# EAGLE schematic DP_eDP_Adapter_v2.0 (EAGLE 6.4)

## Sheet 1 of 3
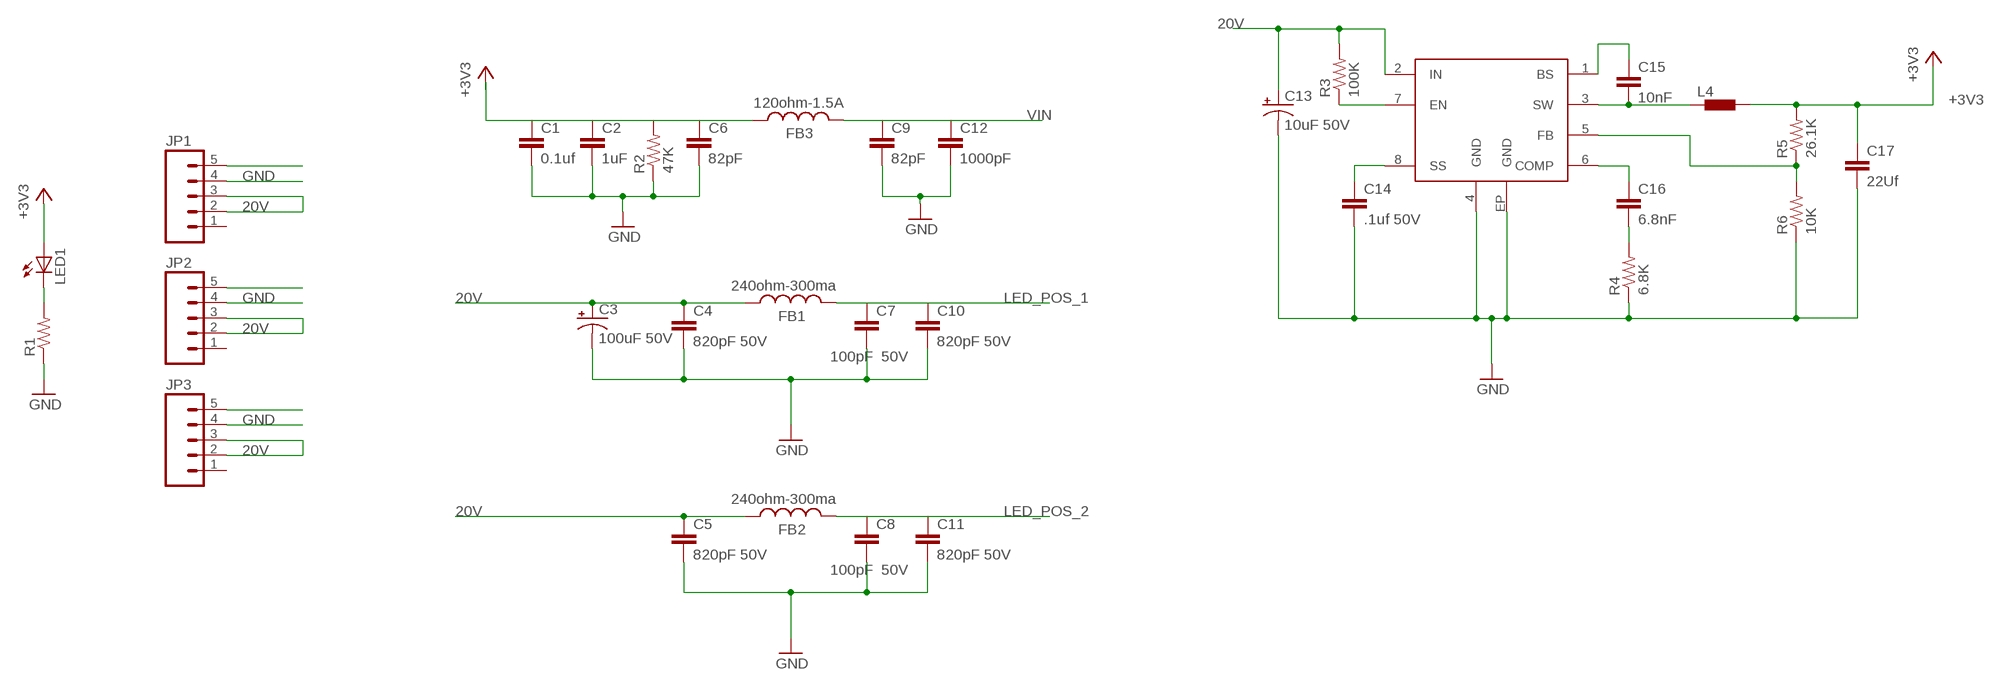
[diagram p0: schematic, sheet 1]

### Parts
C1  0.1uf  CAP0402-CAP  [0402-CAP]
C2  1uF  CAP0402-CAP  [0402-CAP]
C3  100uF 50V  CAP_POL6032  [EIA6032]
C4  820pF 50V  CAP0402-CAP  [0402-CAP]
C5  820pF 50V  CAP0402-CAP  [0402-CAP]
C6  82pF  CAP0402-CAP  [0402-CAP]
C7  100pF 50V  CAP0402-CAP  [0402-CAP]
C8  100pF 50V  CAP0402-CAP  [0402-CAP]
C9  82pF  CAP0402-CAP  [0402-CAP]
C10  820pF 50V  CAP0402-CAP  [0402-CAP]
C11  820pF 50V  CAP0402-CAP  [0402-CAP]
C12  1000pF  CAP0402-CAP  [0402-CAP]
C13  10uF 50V  CAP_POL6032  [EIA6032]
C14  .1uf 50V  CAP0402-CAP  [0402-CAP]
C15  10nF  CAP1206  [1206]
C16  6.8nF  CAP0402-CAP  [0402-CAP]
C17  22Uf  CAP0805  [0805]
FB1  240ohm-300ma  L-US  [R0402]
FB2  240ohm-300ma  L-US  [R0402]
FB3  120ohm-1.5A  L-US  [R0402]
IC1  AP6502A  [SO8-EP]
JP1  M05PTH  [1X05]
JP2  M05PTH  [1X05]
JP3  M05PTH  [1X05]
L4  INDUCTORS_DR10300520C  [0520C]
LED1  LED_LEDCHIPLED_1206  [LED_CHIPLED_1206]
R1  RESISTOR0402-RES  [0402-RES]
R2  47K  RESISTOR0402-RES  [0402-RES]
R3  100K  RESISTOR0402-RES  [0402-RES]
R4  6.8K  RESISTOR0402-RES  [0402-RES]
R5  26.1K  RESISTOR0402-RES  [0402-RES]
R6  10K  RESISTOR0402-RES  [0402-RES]

### Nets
20V [Power]: C3.P$1(+) C4.1 C5.1 C13.P$1(+) FB1.1 FB2.1 IC1.2(IN) JP1.2 JP1.3 JP2.2 JP2.3 JP3.2 JP3.3 R3.2
+3V3: C1.1 C2.1 C6.1 C17.1 FB3.1 L4.P$2 LED1.A R2.2 R5.2 ; also sheet 2,3
GND: C1.2 C2.2 C3.P$2(-) C4.2 C5.2 C6.2 C7.2 C8.2 C9.2 C10.2 C11.2 C12.2 C13.P$2(-) C14.2 C17.2 IC1.4(GND) IC1.EP(GND) JP1.4 JP1.5 JP2.4 JP2.5 JP3.4 JP3.5 R1.1 R2.1 R4.1 R6.1 ; also sheet 2,3
LED_POS_1: C7.1 C10.1 FB1.2 ; also sheet 3
LED_POS_2: C8.1 C11.1 FB2.2 ; also sheet 3
N$2: IC1.7(EN) R3.1
N$3: LED1.C R1.2
N$7: C14.1 IC1.8(SS)
N$8: C16.1 IC1.6(COMP)
N$9: C16.2 R4.2
N$10: IC1.5(FB) R5.1 R6.2
N$14: C15.2 IC1.3(SW) L4.P$1
N$18: C15.1 IC1.1(BS)
VIN: C9.1 C12.1 FB3.2 ; also sheet 3
Unconnected: JP1.1 JP2.1 JP3.1

## Sheet 2 of 3
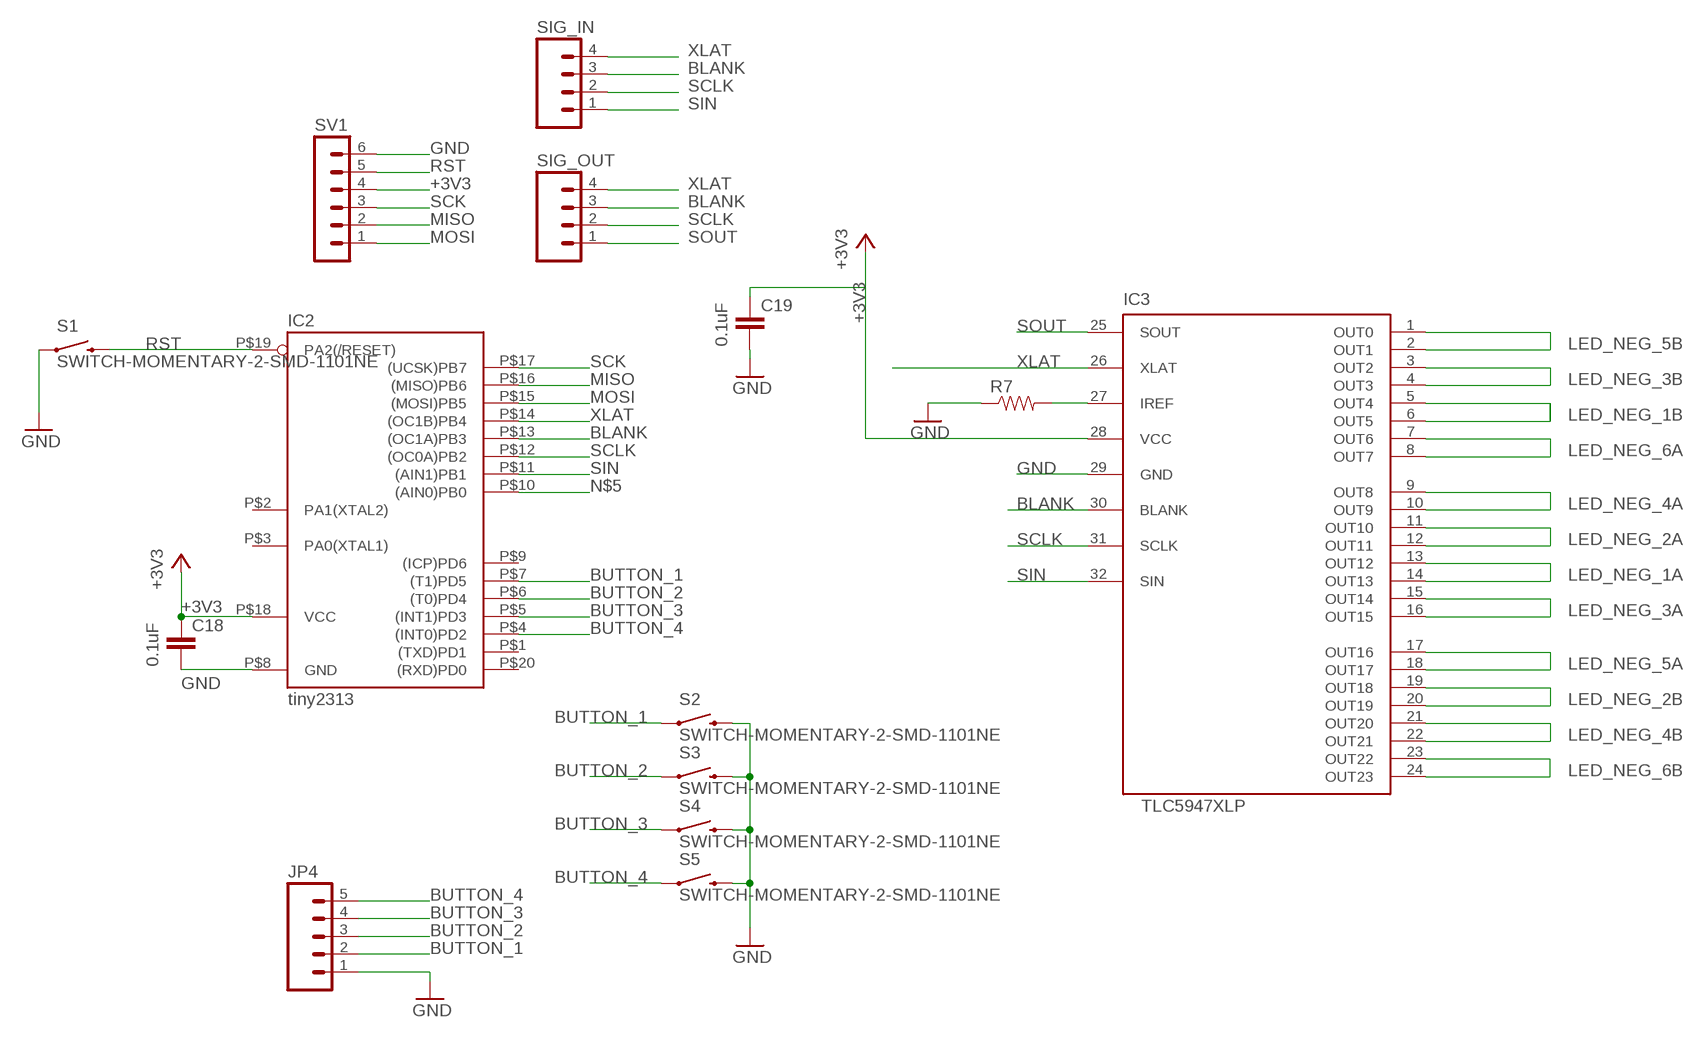
[diagram p1: schematic, sheet 2]

### Parts
C18  0.1uF  CAP0402-CAP  [0402-CAP]
C19  0.1uF  CAP0402-CAP  [0402-CAP]
IC2  tiny2313  TINY2313-*M*  [MLF20]
IC3  TLC5947XLP  [QFN32_XLP]
JP4  M05PTH  [1X05]
R7  RESISTOR0402-RES  [0402-RES]
S1  SWITCH-MOMENTARY-2-SMD-1101NE  [TACTILE-SWITCH-1101NE]
S2  SWITCH-MOMENTARY-2-SMD-1101NE  [TACTILE-SWITCH-1101NE]
S3  SWITCH-MOMENTARY-2-SMD-1101NE  [TACTILE-SWITCH-1101NE]
S4  SWITCH-MOMENTARY-2-SMD-1101NE  [TACTILE-SWITCH-1101NE]
S5  SWITCH-MOMENTARY-2-SMD-1101NE  [TACTILE-SWITCH-1101NE]
SIG_IN  M04PTH  [1X04]
SIG_OUT  M04PTH  [1X04]
SV1  MA06-1  [MA06-1]

### Nets
+3V3: C18.1 C19.1 IC2.P$18(VCC) IC3.28(VCC) SV1.4 ; also sheet 1,3
BLANK: IC2.P$13((OC1A)PB3) IC3.30(BLANK) SIG_IN.3 SIG_OUT.3
BUTTON_1: IC2.P$7((T1)PD5) JP4.2 S2.P$1
BUTTON_2: IC2.P$6((T0)PD4) JP4.3 S3.P$1
BUTTON_3: IC2.P$5((INT1)PD3) JP4.4 S4.P$1
BUTTON_4: IC2.P$4((INT0)PD2) JP4.5 S5.P$1
GND: C18.2 C19.2 IC2.P$8(GND) IC3.29(GND) JP4.1 R7.1 S1.P$1 S2.P$2 S3.P$2 S4.P$2 S5.P$2 SV1.6 ; also sheet 1,3
LED_NEG_1A: IC3.13(OUT12) IC3.14(OUT13) ; also sheet 3
LED_NEG_1B: IC3.5(OUT4) IC3.6(OUT5) ; also sheet 3
LED_NEG_2A: IC3.11(OUT10) IC3.12(OUT11) ; also sheet 3
LED_NEG_2B: IC3.19(OUT18) IC3.20(OUT19) ; also sheet 3
LED_NEG_3A: IC3.15(OUT14) IC3.16(OUT15) ; also sheet 3
LED_NEG_3B: IC3.3(OUT2) IC3.4(OUT3) ; also sheet 3
LED_NEG_4A: IC3.9(OUT8) IC3.10(OUT9) ; also sheet 3
LED_NEG_4B: IC3.21(OUT20) IC3.22(OUT21) ; also sheet 3
LED_NEG_5A: IC3.17(OUT16) IC3.18(OUT17) ; also sheet 3
LED_NEG_5B: IC3.1(OUT0) IC3.2(OUT1) ; also sheet 3
LED_NEG_6A: IC3.7(OUT6) IC3.8(OUT7) ; also sheet 3
LED_NEG_6B: IC3.23(OUT22) IC3.24(OUT23) ; also sheet 3
MISO: IC2.P$16((MISO)PB6) SV1.2
MOSI: IC2.P$15((MOSI)PB5) SV1.1
N$5: IC2.P$10((AIN0)PB0)
N$13: IC3.27(IREF) R7.2
RST: IC2.P$19(PA2(/RESET)) S1.P$2 SV1.5
SCK: IC2.P$17((UCSK)PB7) SV1.3
SCLK: IC2.P$12((OC0A)PB2) IC3.31(SCLK) SIG_IN.2 SIG_OUT.2
SIN: IC2.P$11((AIN1)PB1) IC3.32(SIN) SIG_IN.1
SOUT: IC3.25(SOUT) SIG_OUT.1
XLAT: IC2.P$14((OC1B)PB4) IC3.26(XLAT) SIG_IN.4 SIG_OUT.4
Unconnected: IC2.P$1((TXD)PD1) IC2.P$2(PA1(XTAL2)) IC2.P$3(PA0(XTAL1)) IC2.P$9((ICP)PD6) IC2.P$20((RXD)PD0)

## Sheet 3 of 3
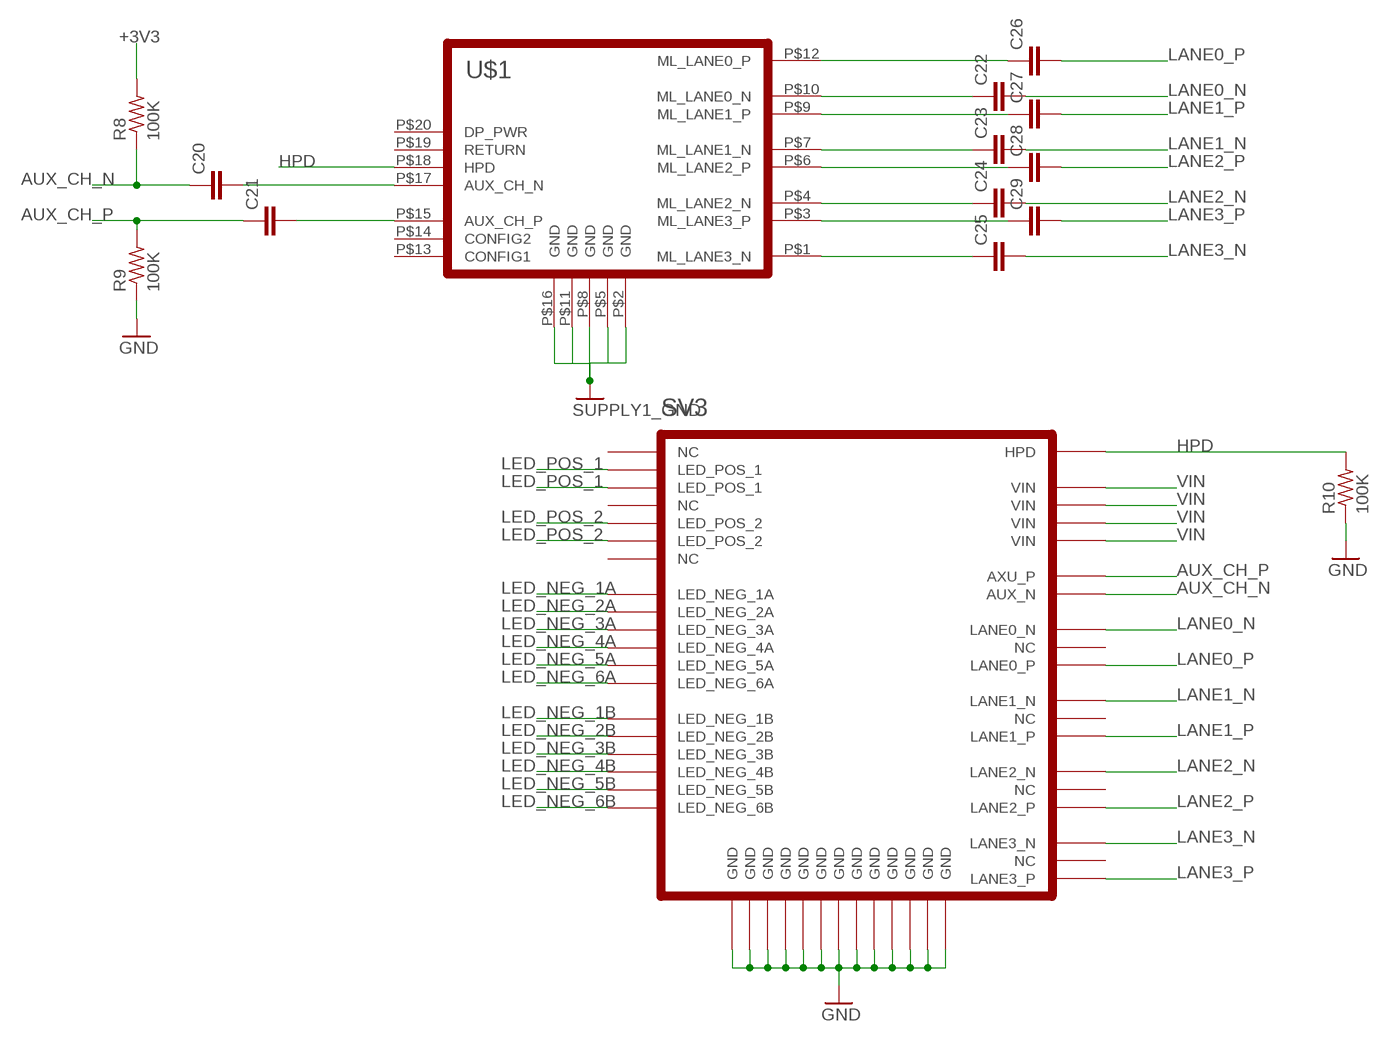
[diagram p2: schematic, sheet 3]

### Parts
C20  SPARKFUN-PASSIVES_CAP0402-CAP  [SPARKFUN-PASSIVES_0402-CAP]
C21  SPARKFUN-PASSIVES_CAP0402-CAP  [SPARKFUN-PASSIVES_0402-CAP]
C22  SPARKFUN-PASSIVES_CAP0402-CAP  [SPARKFUN-PASSIVES_0402-CAP]
C23  SPARKFUN-PASSIVES_CAP0402-CAP  [SPARKFUN-PASSIVES_0402-CAP]
C24  SPARKFUN-PASSIVES_CAP0402-CAP  [SPARKFUN-PASSIVES_0402-CAP]
C25  SPARKFUN-PASSIVES_CAP0402-CAP  [SPARKFUN-PASSIVES_0402-CAP]
C26  SPARKFUN-PASSIVES_CAP0402-CAP  [SPARKFUN-PASSIVES_0402-CAP]
C27  SPARKFUN-PASSIVES_CAP0402-CAP  [SPARKFUN-PASSIVES_0402-CAP]
C28  SPARKFUN-PASSIVES_CAP0402-CAP  [SPARKFUN-PASSIVES_0402-CAP]
C29  SPARKFUN-PASSIVES_CAP0402-CAP  [SPARKFUN-PASSIVES_0402-CAP]
R8  100K  R-US_R0402  [R0402]
R9  100K  R-US_R0402  [R0402]
R10  100K  R-US_R0402  [R0402]
SV3  DP_EDP_ADAPTER_DP_EDP_ADAPTER_EDP_CONNECTOR  [DP_EDP_ADAPTER_DP_EDP_ADAPTER_EDP_MOLEX]
U$1  DP_EDP_ADAPTER_DP1RD20JQ2R400_SINK  [DP_EDP_ADAPTER_DP_REVERSE_JAE]

### Nets
+3V3: R8.2 ; also sheet 1,2
AUX_CH_N: C20.1 R8.1 SV3.P$10(AUX_N)
AUX_CH_P: C21.1 R9.2 SV3.P$9(AXU_P)
AUX_N: C20.2 U$1.P$17(AUX_CH_N)
AUX_P: C21.2 U$1.P$15(AUX_CH_P)
GND: R9.1 R10.1 SV3.P$1(GND) SV3.P$3(GND) SV3.P$8(GND) SV3.P$11(GND) SV3.P$15(GND) SV3.P$19(GND) SV3.P$23(GND) SV3.P$27(GND) SV3.P$28(GND) SV3.P$29(GND) SV3.P$36(GND) SV3.P$43(GND) SV3.P$51(GND) U$1.P$2(GND) U$1.P$5(GND) U$1.P$8(GND) U$1.P$11(GND) U$1.P$16(GND) ; supply symbol labelled SUPPLY1_GND ; also sheet 1,2
HPD: R10.2 SV3.P$2(HPD) U$1.P$18(HPD)
LANE0_N: C22.2 SV3.P$12(LANE0_N)
LANE0_P: C26.2 SV3.P$14(LANE0_P)
LANE1_N: C23.2 SV3.P$16(LANE1_N)
LANE1_P: C27.2 SV3.P$18(LANE1_P)
LANE2_N: C24.2 SV3.P$20(LANE2_N)
LANE2_P: C28.2 SV3.P$22(LANE2_P)
LANE3_N [DP]: C25.2 SV3.P$24(LANE3_N)
LANE3_P [DP]: C29.2 SV3.P$26(LANE3_P)
LED_NEG_1A: SV3.P$42(LED_NEG_1A) ; also sheet 2
LED_NEG_1B: SV3.P$35(LED_NEG_1B) ; also sheet 2
LED_NEG_2A: SV3.P$41(LED_NEG_2A) ; also sheet 2
LED_NEG_2B: SV3.P$34(LED_NEG_2B) ; also sheet 2
LED_NEG_3A: SV3.P$40(LED_NEG_3A) ; also sheet 2
LED_NEG_3B: SV3.P$33(LED_NEG_3B) ; also sheet 2
LED_NEG_4A: SV3.P$39(LED_NEG_4A) ; also sheet 2
LED_NEG_4B: SV3.P$32(LED_NEG_4B) ; also sheet 2
LED_NEG_5A: SV3.P$38(LED_NEG_5A) ; also sheet 2
LED_NEG_5B: SV3.P$31(LED_NEG_5B) ; also sheet 2
LED_NEG_6A: SV3.P$37(LED_NEG_6A) ; also sheet 2
LED_NEG_6B: SV3.P$30(LED_NEG_6B) ; also sheet 2
LED_POS_1: SV3.P$48(LED_POS_1) SV3.P$49(LED_POS_1) ; also sheet 1
LED_POS_2: SV3.P$45(LED_POS_2) SV3.P$46(LED_POS_2) ; also sheet 1
N$3_N [DP]: C22.1 U$1.P$10(ML_LANE0_N)
N$3_P [DP]: C26.1 U$1.P$12(ML_LANE0_P)
N$15_N [DP]: C23.1 U$1.P$7(ML_LANE1_N)
N$15_P [DP]: C27.1 U$1.P$9(ML_LANE1_P)
N$17_N [DP]: C24.1 U$1.P$4(ML_LANE2_N)
N$17_P [DP]: C28.1 U$1.P$6(ML_LANE2_P)
N$19_N [DP]: C25.1 U$1.P$1(ML_LANE3_N)
N$19_P [DP]: C29.1 U$1.P$3(ML_LANE3_P)
VIN: SV3.P$4(VIN) SV3.P$5(VIN) SV3.P$6(VIN) SV3.P$7(VIN) ; also sheet 1
Unconnected: SV3.P$13(NC) SV3.P$17(NC) SV3.P$21(NC) SV3.P$25(NC) SV3.P$44(NC) SV3.P$47(NC) SV3.P$50(NC) U$1.P$13(CONFIG1) U$1.P$14(CONFIG2) U$1.P$19(RETURN) U$1.P$20(DP_PWR)

## Library data of the parts
C1 C2 C4-C12 C14-C17 = SparkFun-Passives:CAP: Capacitor Standard 0603 ceramic capacitor, and 0.1" leaded capacitor.
C3 C13 = SparkFun-Passives:CAP_POL: Capacitor Polarized These are standard SMD and PTH capacitors. Normally 10uF, 47uF, and 100uF in electrolytic and tantalum varieties. Always verify the external diameter of the through hole cap, it varies with capacity, voltage, and manufacturer. The EIA devices should be standard.
C18 C19 = SparkFun:CAP: Capacitor Standard 0603 ceramic capacitor, and 0.1" leaded capacitor.
C20-C29 = DP_eDP_Adapter:SPARKFUN-PASSIVES_CAP: Capacitor Standard 0603 ceramic capacitor, and 0.1" leaded capacitor.
FB1-FB3 = rcl:L-US: INDUCTOR, American symbol
IC1 = DP_eDP_Adapter:AP6502A
IC2 = NSL_Cylon:TINY2313*: Atmel Tiny2313 2K Flash, 128 bytes EEPROM, 128 bytes RAM
IC3 = slice_noshift:TLC5947
JP1-JP4 = SparkFun-Connectors:M05: Header 5 Standard 5-pin 0.1" header. Use with straight break away headers (SKU : PRT-00116), right angle break away headers (PRT-00553), swiss pins (PRT-00743), machine pins (PRT-00117), and female headers (PRT-00115). Molex polarized connector foot print use with SKU : PRT-08230 with associated crimp pins and housings.
L4 = DP_eDP_Adapter_v1.1:INDUCTORS_DR1030: DR1030 Series Low Profile Power Inductors Source: Data sheet <http://www.cooperbussmann.com/pdf/c73e479f-f867-4c64-ae26-9c1f23814163.pdf>
LED1 = badge.lbrbadge_2013:LED_LED: LED OSRAM: - CHIPLED LG R971, LG N971, LY N971, LG Q971, LY Q971, LO R971, LY R971 LH N974, LH R974 LS Q976, LO Q976, LY Q976 LO Q996 - Hyper CHIPLED LW Q18S LB Q993, LB Q99A, LB R99A - SideLED LS A670, LO A670, LY A670, LG A670, LP A670 LB A673, LV A673, LT A673, LW A673 LH A674 LY A675 LS A676, LA A676, LO A676, LY A676, LW A676 LS A679, LY A679, LG A679 - Hyper Micro SIDELED® LS Y876, LA Y876, LO Y876, LY Y876 LT Y87S - SmartLED LW L88C, LW L88S LB L89C, LB L89S, LG L890 LS L89K, LO L89K, LY L89K LS L896, LA L896, LO L896, LY L896 - TOPLED LS T670, LO T670, LY T670, LG T670, LP T670 LSG T670, LSP T670, LSY T670, LOP T670, LYG T670 LG T671, LOG T671, LSG T671 LB T673, LV T673, LT T673, LW T673 LH T674 LS T676, LA T676, LO T676, LY T676, LB T676, LH T676, LSB T676, LW T676 LB T67C, LV T67C, LT T67C, LS T67K, LO T67K, LY T67K, LW E67C LS E67B, LA E67B, LO E67B, LY E67B, LB E67C, LV E67C, LT E67C LW T67C LS T679, LY T679, LG T679 LS T770, LO T770, LY T770, LG T770, LP T770 LB T773, LV T773, LT T773, LW T773 LH T774 LS E675, LA E675, LY E675, LS T675 LS T776, LA T776, LO T776, LY T776, LB T776 LHGB T686 LT T68C, LB T68C - Hyper Mini TOPLED® LB M676 - Mini TOPLED Santana® LG M470 LS M47K, LO M47K, LY M47K Source: http://www.osram.convergy.de LUXEON: - LUMILED® LXK2-PW12-R00, LXK2-PW12-S00, LXK2-PW14-U00, LXK2-PW14-V00 LXK2-PM12-R00, LXK2-PM12-S00, LXK2-PM14-U00 LXK2-PE12-Q00, LXK2-PE12-R00, LXK2-PE12-S00, LXK2-PE14-T00, LXK2-PE14-U00 LXK2-PB12-K00, LXK2-PB12-L00, LXK2-PB12-M00, LXK2-PB14-N00, LXK2-PB14-P00, LXK2-PB14-Q00 LXK2-PR12-L00, LXK2-PR12-M00, LXK2-PR14-Q00, LXK2-PR14-R00 LXK2-PD12-Q00, LXK2-PD12-R00, LXK2-PD12-S00 LXK2-PH12-R00, LXK2-PH12-S00 LXK2-PL12-P00, LXK2-PL12-Q00, LXK2-PL12-R00 Source: www.luxeon.com KINGBRIGHT: KA-3528ASYC Source: www.kingbright.com
R1-R7 = SparkFun-Passives:RESISTOR: Resistor Basic schematic elements and footprints for 0603, 1206, and PTH resistors.
R8-R10 = rcl:R-US_: RESISTOR, American symbol
S1-S5 = SparkFun-Electromechanical:SWITCH-MOMENTARY-2: Various NO switches- pushbuttons, reed, etc
SIG_IN SIG_OUT = SparkFun-Connectors:M04: Header 4 Standard 4-pin 0.1" header. Use with straight break away headers (SKU : PRT-00116), right angle break away headers (PRT-00553), swiss pins (PRT-00743), machine pins (PRT-00117), and female headers (PRT-00115). Molex polarized connector foot print use with SKU : PRT-08231 with associated crimp pins and housings. 1MM SMD Version SKU: PRT-10208
SV1 = NSL:MA06-1: PIN HEADER
SV3 = DP_eDP_Adapter_v2.0:DP_EDP_ADAPTER_DP_EDP_ADAPTER_EDP_CONNECTOR
U$1 = DP_eDP_Adapter_v2.0:DP_EDP_ADAPTER_DP1RD20JQ2R400

## Net classes
0 default: width 0.203 mm
1 DP: width 0.203 mm, drill 0.305 mm, clearance 0.203 mm
2 Power: width 0.305 mm